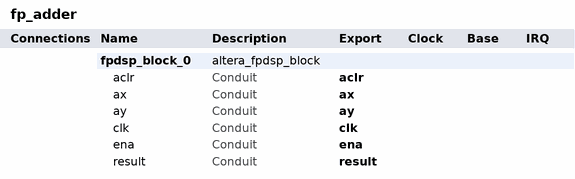
[diagram p0: system contents]
# Platform Designer (Qsys) system fp_adder, Arria 10 10AS016C3U19E2LG
# Parameters at their usual value, and those the tool derives, are not listed.
package require -exact qsys 17.1
create_system fp_adder
set_project_property DEVICE_FAMILY {Arria 10}
set_project_property DEVICE 10AS016C3U19E2LG

add_instance fpdsp_block_0 altera_fpdsp_block 17.1
set_instance_property fpdsp_block_0 AUTO_EXPORT true
set_instance_parameter_value fpdsp_block_0 OPERATION sp_add
set_instance_parameter_value fpdsp_block_0 VIEW {Register Enables}
set_instance_parameter_value fpdsp_block_0 accum_adder_clock 0
set_instance_parameter_value fpdsp_block_0 accum_pipeline_clock 0
set_instance_parameter_value fpdsp_block_0 accumulate_clock 0
set_instance_parameter_value fpdsp_block_0 adder_input_2_clock NONE
set_instance_parameter_value fpdsp_block_0 adder_input_clock NONE
set_instance_parameter_value fpdsp_block_0 adder_subtract true
set_instance_parameter_value fpdsp_block_0 ax_chainin_pl_clock NONE
set_instance_parameter_value fpdsp_block_0 ax_clock NONE
set_instance_parameter_value fpdsp_block_0 ay_clock NONE
set_instance_parameter_value fpdsp_block_0 az_clock 0
set_instance_parameter_value fpdsp_block_0 chain_mux 0
set_instance_parameter_value fpdsp_block_0 chain_out_mux 0
set_instance_parameter_value fpdsp_block_0 design_env NATIVE
set_instance_parameter_value fpdsp_block_0 mult_pipeline_clock 0
set_instance_parameter_value fpdsp_block_0 output_clock 0
set_instance_parameter_value fpdsp_block_0 single_clear false

# exported interfaces
add_interface aclr conduit end
set_interface_property aclr EXPORT_OF fpdsp_block_0.aclr
add_interface ax conduit end
set_interface_property ax EXPORT_OF fpdsp_block_0.ax
add_interface ay conduit end
set_interface_property ay EXPORT_OF fpdsp_block_0.ay
add_interface clk conduit end
set_interface_property clk EXPORT_OF fpdsp_block_0.clk
add_interface ena conduit end
set_interface_property ena EXPORT_OF fpdsp_block_0.ena
add_interface result conduit end
set_interface_property result EXPORT_OF fpdsp_block_0.result

set_interconnect_requirement {$system} qsys_mm.clockCrossingAdapter HANDSHAKE
set_interconnect_requirement {$system} qsys_mm.enableEccProtection FALSE
set_interconnect_requirement {$system} qsys_mm.insertDefaultSlave FALSE
set_interconnect_requirement {$system} qsys_mm.maxAdditionalLatency 1

save_system fp_adder.qsys
